# EAGLE design FilterSupply (EAGLE 6.6.0)
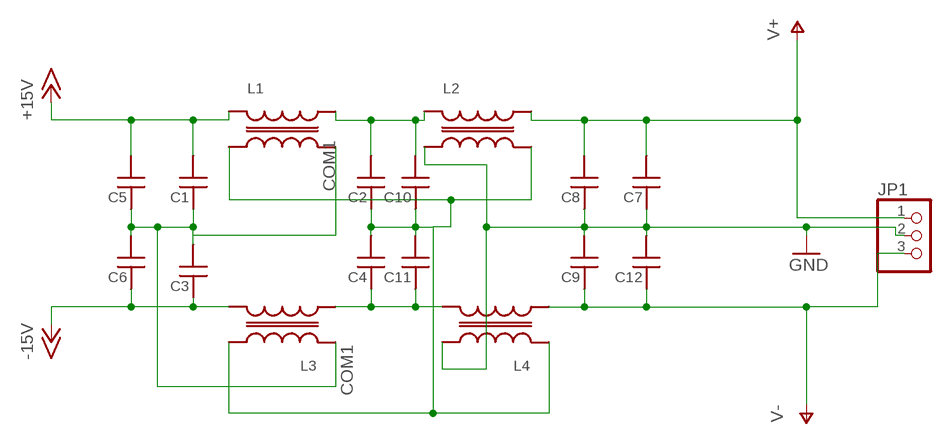
[diagram p0: schematic, sheet 1]

## Parts
C1  C_MLCC_SMDCMLCC_0805  [C_MLCC_0805]
C2  C_MLCC_SMDCMLCC_0603  [C_MLCC_0603]
C3  C_MLCC_SMDCMLCC_0805  [C_MLCC_0805]
C4  C_MLCC_SMDCMLCC_0603  [C_MLCC_0603]
C5  C_MLCC_SMDCMLCC_0805  [C_MLCC_0805]
C6  C_MLCC_SMDCMLCC_0805  [C_MLCC_0805]
C7  C_MLCC_SMDCMLCC_0603  [C_MLCC_0603]
C8  C_MLCC_SMDCMLCC_0603  [C_MLCC_0603]
C9  C_MLCC_SMDCMLCC_0603  [C_MLCC_0603]
C10  C_MLCC_SMDCMLCC_0603  [C_MLCC_0603]
C11  C_MLCC_SMDCMLCC_0603  [C_MLCC_0603]
C12  C_MLCC_SMDCMLCC_0603  [C_MLCC_0603]
JP1  PINHD-1X3  [1X03]
L1  MSD7342  [MSD7342]
L2  MSD7342  [MSD7342]
L3  MSD7342  [MSD7342]
L4  MSD7342  [MSD7342]

## Nets
+15V: C1.P$2 C5.P$2 L1.2
-15V: C3.P$1 C6.P$1 L3.3
COM1: C1.P$1 C3.P$2 C5.P$1 C6.P$2 L1.3 L3.2
GND: C7.P$1 C8.P$1 C9.P$2 C12.P$2 JP1.2 L2.1 L4.4
N$1: C2.P$2 C10.P$2 L1.4 L2.2
N$3: C2.P$1 C4.P$2 C10.P$1 C11.P$2 L1.1 L2.3 L3.4 L4.2
N$5: C4.P$1 C11.P$1 L3.1 L4.3
V+: C7.P$2 C8.P$2 JP1.1 L2.4
V-: C9.P$1 C12.P$1 JP1.3 L4.1

## Library data of the parts
C1-C12 = jqi_passives:C_MLCC_SMD
JP1 = pinhead:PINHD-1X3: PIN HEADER
L1-L4 = coilcraft-jqi:MSD7342: MSD1260 series 1:1 coupled inductors

## Board
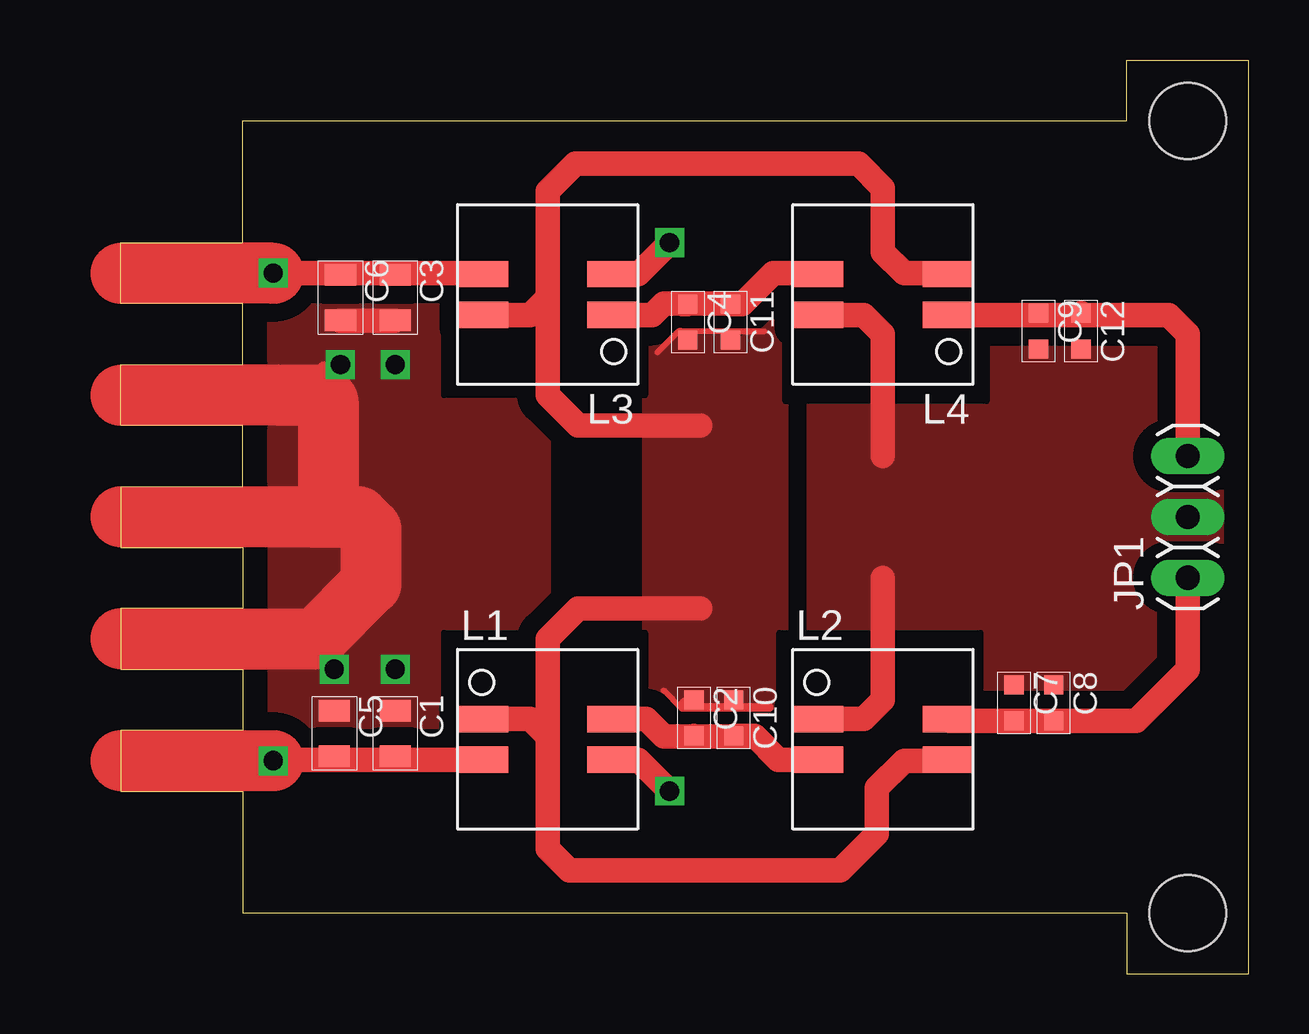
[diagram p1: board, top side]
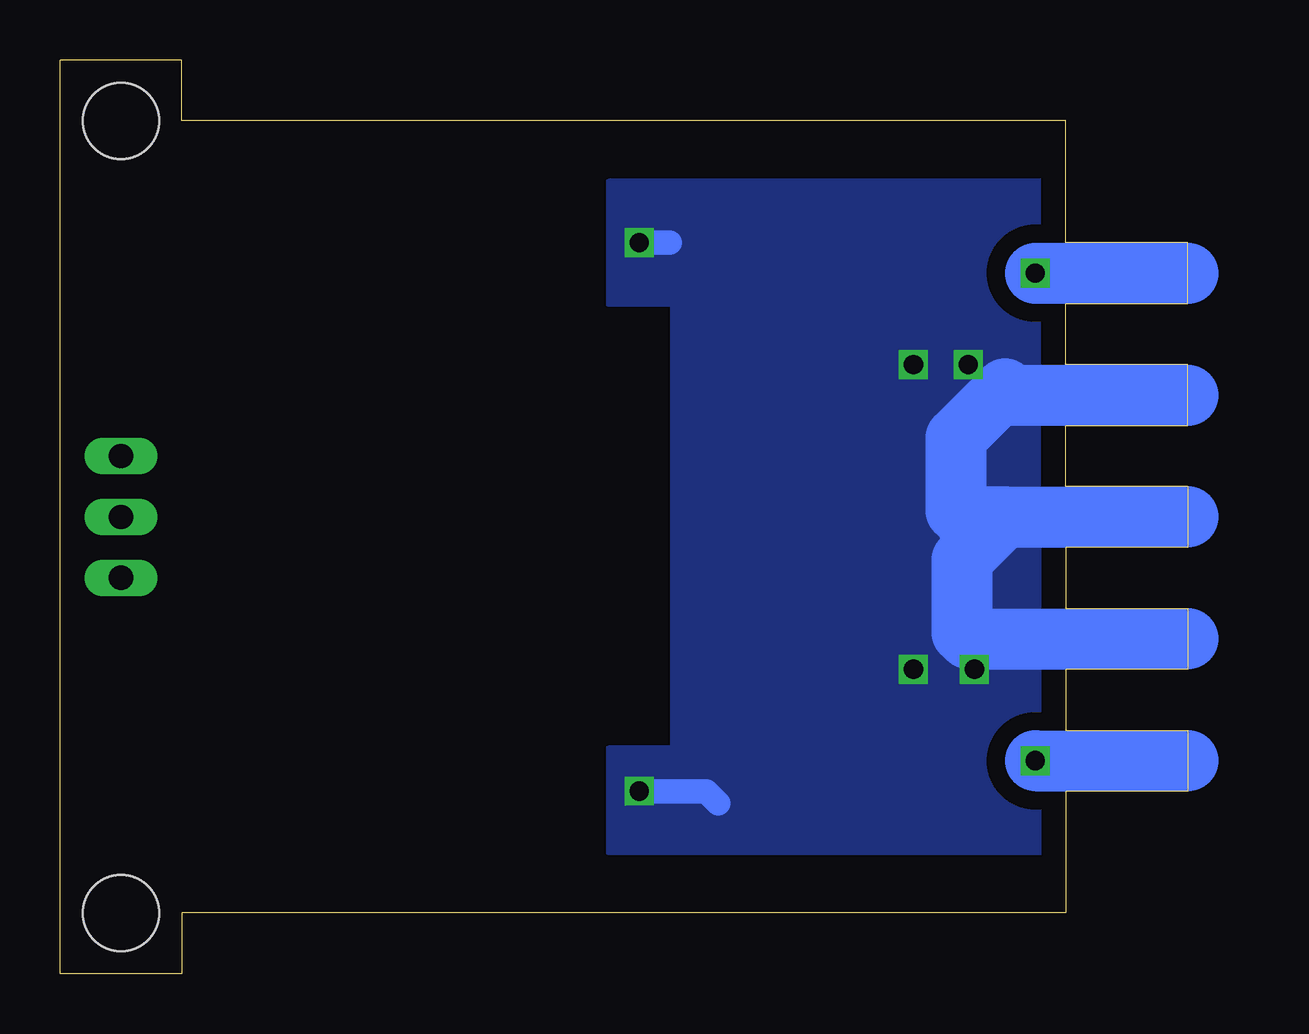
[diagram p2: board, bottom side, seen from below]

Size 46.99 x 38.1 mm. Coordinates in mm from the lower left corner, seen from the top.
Outline: 0,20.32 0,17.78 5.08,17.78 5.08,15.24 0,15.24 0,12.7 5.08,12.7 5.08,10.16 0,10.16 0,7.62 5.08,7.62 5.08,2.54 41.91,2.54 41.91,0 46.99,0 46.99,38.1 41.91,38.1 41.91,35.56 5.08,35.56 5.08,30.48 0,30.48 0,27.94 5.08,27.94 5.08,25.4 0,25.4 0,22.86 5.08,22.86 5.08,20.32 0,20.32
Copper layers (1*16): Top 0.035mm / dielectric 1.5mm / Bottom 0.035mm
Design rules "default *": minimum track width 10mil, minimum drill 0.6mm, track to track 8mil, track to pad 8mil, pad to pad 8mil, via to via 8mil, smd to smd 8mil, copper to edge 40mil, drill to drill 8mil, minimum pad ring 10mil, minimum via ring 8mil, stop-mask expansion 4mil, vias tented up to drill 0mil, thermal gap 10mil
Holes 3.17 mm at 44.45,35.56 44.45,2.54

### Footprints (pad centres in the part's own frame; a part is rotated, then mirrored left to right if it is on the bottom)
C_MLCC_0805 = smd 0.9 x 1.3: P$1 -0.95,0; P$2 0.95,0
C_MLCC_0603 = smd 0.8 x 0.8: P$1 -0.75,0; P$2 0.75,0
1X03 = drill 1.016 long: 1 -2.54,0; 2 0,0; 3 2.54,0
MSD7342 = smd 2.1 x 1.1: 1 -2.7,0.85; 2 -2.7,-0.85; 3 2.7,-0.85; 4 2.7,0.85

### Placement (x,y rotation side)
C1  11.43,10.03 270 top
C2  23.88,10.67 270 top
C3  11.43,28.19 270 top
C4  23.62,27.18 270 top
C5  8.89,10.03 270 top
C6  9.14,28.19 270 top
C7  37.21,11.3 270 top
C8  38.86,11.3 270 top
C9  38.23,26.8 270 top
C10  25.53,10.67 270 top
C11  25.4,27.18 270 top
C12  40.01,26.8 270 top
JP1  44.45,19.05 90 top
L1  17.78,9.78 0 top
L2  31.75,9.78 0 top
L3  17.78,28.32 180 top
L4  31.75,28.32 180 top

### Tracks (layer width: path | path; a pad name or v marks a point on that pad's centre or on a via)
+15V  (via drill 0.8)
  Top 0.406: 4.82,8.93 3.81,8.93 v6.35,8.89
  Top 0.508: C1.P$2 11.3,9.08 11.3,8.93 | C5.P$2 9.02,9.08 9.02,8.93
  Top 1.016: L1.2 11.3,8.93 9.02,8.93 4.82,8.93 3.05,8.93 3.05,8.89
  Top 2.54: v6.35,8.89 0,8.89
  Bottom 2.54: v6.35,8.89 0,8.89
-15V  (via drill 0.8)
  Top 0.508: C6.P$1 9.08,29.21 8.64,29.21 | C3.P$1 11.36,29.21 10.67,29.21
  Top 1.016: L3.3 15.04,29.21 10.67,29.21 8.64,29.21 v6.35,29.21 2.54,29.21
  Top 2.54: v6.35,29.21 0,29.21
  Bottom 2.54: v6.35,29.21 0,29.21
COM1  (via drill 0.8)
  Top 0.254: v9.14,25.4 8.38,25.4 7.11,24.13
  Top 1.016: L3.2 21.55,29.17 v22.86,30.48 | C6.P$2 C3.P$2 | L1.3 21.55,8.93 v22.86,7.62
  Top 1.524: 7.11,24.13 6.6,24.13
  Top 2.54: 0,24.13 6.6,24.13 8.38,24.13 8.64,23.88 8.64,19.81 7.87,19.05 | 7.87,19.05 0,19.05 | 7.87,19.05 9.91,19.05 10.41,18.54 10.41,16.26 8.13,13.97 0,13.97
  Bottom 1.016: v22.86,30.48 21.59,30.48 | v22.86,7.62 20.07,7.62 19.56,7.11
  Bottom 2.54: 0,13.97 9.14,13.97 9.4,14.22 9.4,17.27 7.62,19.05 | 7.62,19.05 0,19.05 | 7.62,19.05 9.4,19.05 9.65,19.3 9.65,22.35 7.62,24.38 7.37,24.13 0,24.13
  other vias: 11.43,25.4 11.43,12.7 8.89,12.7
  pour Bottom (isolate 0.762): 0,33.02 24.13,33.02 24.13,31.75 24.13,27.94 21.46,27.94 21.46,9.4 24.13,9.4 24.13,5.08 0,5.08
  pour Top (isolate 0.762, no thermals): 0,33.02 17.78,33.02 17.78,5.08 0,5.08
GND
  Top 1.016: L2.1 30.95,10.63 31.75,11.43 31.75,16.51 | L4.4 30.95,27.47 31.75,26.67 31.75,21.59
  pour Top (isolate 0.762, rank 2, no thermals): 27.94,27.94 46.99,27.94 46.99,10.16 27.94,10.16
N$1
  Top 1.016: L1.4 21.88,10.63 22.61,9.91 23.61,9.91 | 23.61,9.91 25.77,9.91 C10.P$2 26.4,9.92 27.39,8.93 L2.2 | C2.P$2 23.61,9.91
N$2
  cutout Top: 13.46,32.26 21.84,32.26 21.84,24.13 13.46,24.13
  cutout Top: 13.46,14.22 21.84,14.22 21.84,5.84 13.46,5.84
  cutout Top: 27.43,14.22 35.81,14.22 35.81,5.84 27.43,5.84
  cutout Top: 27.69,32.51 36.07,32.51 36.07,23.88 27.69,23.88
N$3
  Top 0.254: C2.P$1 23.48,11.42 23.24,11.18 27.05,11.18 27.05,11.05 23.37,11.05 22.61,11.81 | C4.P$2 23.62,26.54 23.37,26.8 | 23.37,26.8 26.8,26.8 | 23.37,26.8 23.24,26.8 22.35,25.91
  Top 1.016: L1.1 17.06,10.63 17.78,9.91 | 17.78,9.91 17.78,5.21 18.67,4.32 29.97,4.32 31.5,5.84 31.5,7.75 32.64,8.89 34.41,8.89 L2.3 | L3.4 17.06,27.47 17.78,28.19 | 17.78,28.19 17.78,32.64 18.92,33.78 30.73,33.78 31.75,32.77 31.75,30.1 32.64,29.21 34.41,29.21 L4.2 | 17.78,9.91 17.78,13.97 19.05,15.24 24.13,15.24 | 17.78,28.19 17.78,24.13 19.05,22.86 24.13,22.86
  pour Top (isolate 0.762, no thermals): 21.84,27.18 27.69,27.18 27.69,10.67 21.84,10.67
N$5
  Top 1.016: L3.1 22.14,27.47 22.61,27.94 23.37,27.94 | 23.37,27.94 25.39,27.94 C11.P$1 25.9,27.93 27.18,29.21 29.01,29.21 L4.3 | C4.P$1 23.38,27.93 23.37,27.94
V+
  Top 1.016: L2.4 34.53,10.55 C7.P$2 C8.P$2 42.3,10.55 44.45,12.7 JP1.1
V-
  Top 0.508: C9.P$1 38.28,27.55 38.35,27.47
  Top 1.016: L4.1 38.35,27.47 39.93,27.47 | 39.93,27.47 C12.P$1 | 39.93,27.47 43.65,27.47 44.45,26.67 JP1.3